# Altium schematic sheet PIC32MK.SchDoc
size A4; SheetNumber: 9; SheetTotal: 13
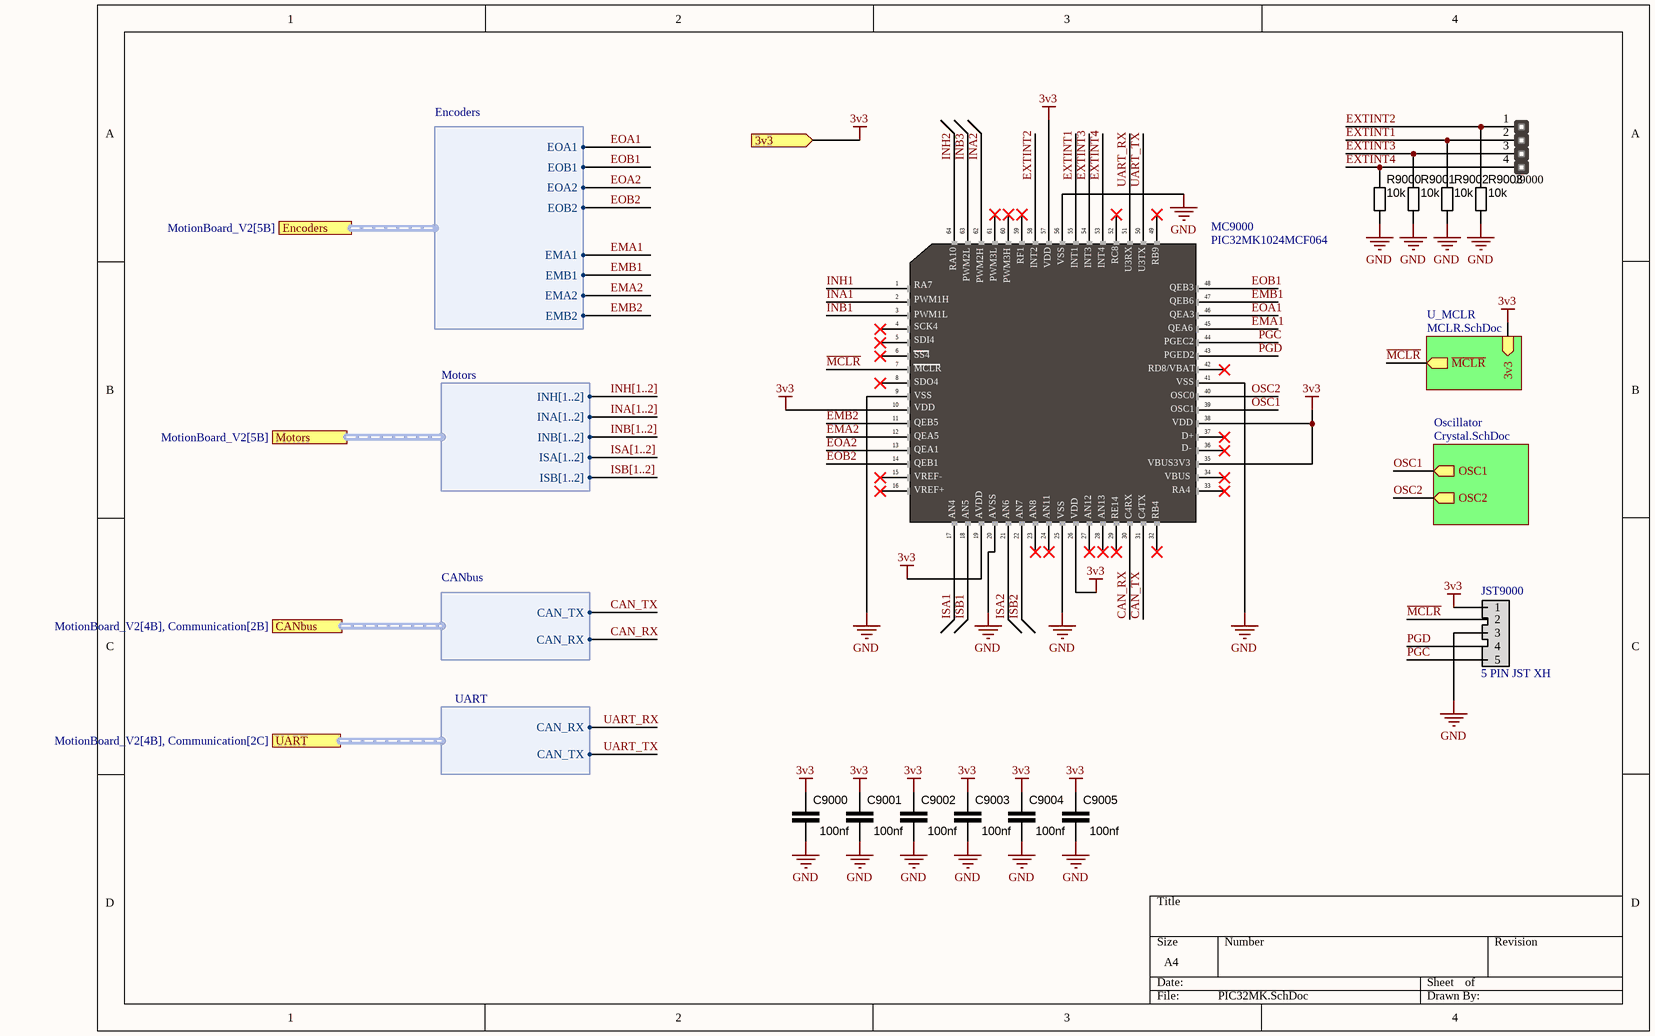
[diagram p0: PIC32MK.SchDoc]

## Parts
C9000  100nf  [CAP_0603]
C9001  100nf  [CAP_0603]
C9002  100nf  [CAP_0603]
C9003  100nf  [CAP_0603]
C9004  100nf  [CAP_0603]
C9005  100nf  [CAP_0603]
J9000  EXTINT  [HM1X4]  (value not drawn)
JST9000  5 PIN JST XH  [JST5PIN]
MC9000  PIC32MK1024MCF064  [PIC32MK_64-TQFP]
R9000  10k  [RES_0603]
R9001  10k  [RES_0603]
R9002  10k  [RES_0603]
R9003  10k  [RES_0603]

## Sub-sheets
Oscillator = Crystal.SchDoc: OSC1 (out), OSC2 (out)
U_MCLR = MCLR.SchDoc: ~{MCLR} (out), 3v3 (in)

## Ports
3v3 (in, see MotionBoard_V2[4B], CAN[2B], Communication[3B], LDO[2B], MCLR[3B], Power[2B]), CANbus (harness CANbus, see MotionBoard_V2[4B], Communication[2B]), Encoders (harness Encoders, see MotionBoard_V2[5B]), Motors (harness Motors, see MotionBoard_V2[5B]), UART (harness UART, see MotionBoard_V2[4B], Communication[2C])

## Harnesses
Motors: INH[1..2], INA[1..2], INB[1..2], ISA[1..2], ISB[1..2]
CANbus: CAN_TX, CAN_RX
UART: CAN_RX, CAN_TX
Encoders: EOA1, EOB1, EOA2, EOB2, EMA1, EMB1, EMA2, EMB2

## Nets
3v3: C9000.2 C9001.2 C9002.2 C9003.2 C9004.2 C9005.2 JST9000.1 MC9000.10 MC9000.19 MC9000.26 MC9000.35 MC9000.38 MC9000.57 ; port 3v3, sheet U_MCLR/3v3
GND: C9000.1 C9001.1 C9002.1 C9003.1 C9004.1 C9005.1 JST9000.3 MC9000.9 MC9000.20 MC9000.25 MC9000.41 MC9000.56 R9000.1 R9001.1 R9002.1 R9003.1
~{MCLR}: JST9000.2 MC9000.7 ; sheet U_MCLR/~{MCLR}
CAN_RX: MC9000.30 ; port CANbus.CAN_RX
CAN_TX: MC9000.31 ; port CANbus.CAN_TX
EMA1: MC9000.45 ; port Encoders.EMA1
EMA2: MC9000.12 ; port Encoders.EMA2
EMB1: MC9000.47 ; port Encoders.EMB1
EMB2: MC9000.11 ; port Encoders.EMB2
EOA1: MC9000.46 ; port Encoders.EOA1
EOA2: MC9000.13 ; port Encoders.EOA2
EOB1: MC9000.48 ; port Encoders.EOB1
EOB2: MC9000.14 ; port Encoders.EOB2
EXTINT1: J9000.2 MC9000.55 R9002.2
EXTINT2: J9000.1 MC9000.58 R9003.2
EXTINT3: J9000.3 MC9000.54 R9001.2
EXTINT4: J9000.4 MC9000.53 R9000.2
INA1: MC9000.2
INA2: MC9000.62
INB1: MC9000.3
INB3: MC9000.63
INH1: MC9000.1
INH2: MC9000.64
ISA1: MC9000.17
ISA2: MC9000.21
ISB1: MC9000.18
ISB2: MC9000.22
OSC1: MC9000.39 ; sheet Oscillator/OSC1
OSC2: MC9000.40 ; sheet Oscillator/OSC2
PGC: JST9000.5 MC9000.44
PGD: JST9000.4 MC9000.43
UART_RX: MC9000.51 ; port UART.CAN_RX
UART_TX: MC9000.50 ; port UART.CAN_TX

Not connected (* = marked no-connect by the designer): MC9000 4* 5* 6* 8* 15* 16* 23* 24* 27* 28* 29* 32* 33* 34* 36* 37* 42* 49* 52* 59* 60* 61*

## Buses and harness runs
bus INA[1..2]
bus INB[1..2]
bus INH[1..2]
bus ISA[1..2]
bus ISB[1..2]

## Notes on the sheet
- (in symbol PIC32MK) RF1; RC8; RA10; INT2; VDD; VSS; INT1; INT3; INT4; RB9; U3RX; U3TX; PWM2L; PWM2H; PWM3L; PWM3H; RA7; QEB3; PWM1H; QEB6; PWM1L; QEA3; SCK4; QEA6; SDI4; PGEC2; SS4; PGED2; MCLR; RD8/VBAT; SDO4; OSC0; OSC1; QEB5; QEA5; D+; QEA1; D-; QEB1; VBUS3V3; VREF-; VBUS; VREF+; RA4; AN4; AN5; AVDD; AVSS; AN6; AN7; AN8; AN11; AN12; AN13; RE14; C4RX; C4TX; RB4

## Library data of the parts
C9000-C9005 = C000007: CAP CER 100nF 0603 25V X7R; capaticanse: 100nf; ComponentLink1Description: digikey; ComponentLink1URL: https://www.digikey.com/en/products/detail/kyocera-avx/06033C104K4T2A/8019250
J9000 = HEADER_1x4_1
JST9000 = JST5PIN: 5 PIN JST XH 2.5mm pitch
MC9000 = PIC32MK: PIC32 Motor Control Microcontroller / PIC32MK1024MCF064 / PIC32MK1024MCM064 / Compatible
R9000-R9003 = R000001: RES 10K OHM 1% 1/10W 0603; resistance: 10Kohm; ComponentLink1Description: digikey; ComponentLink1URL: https://www.digikey.com/en/products/detail/vishay-beyschlag-draloric-bc-components/MCT06030C1002FP500/1850440